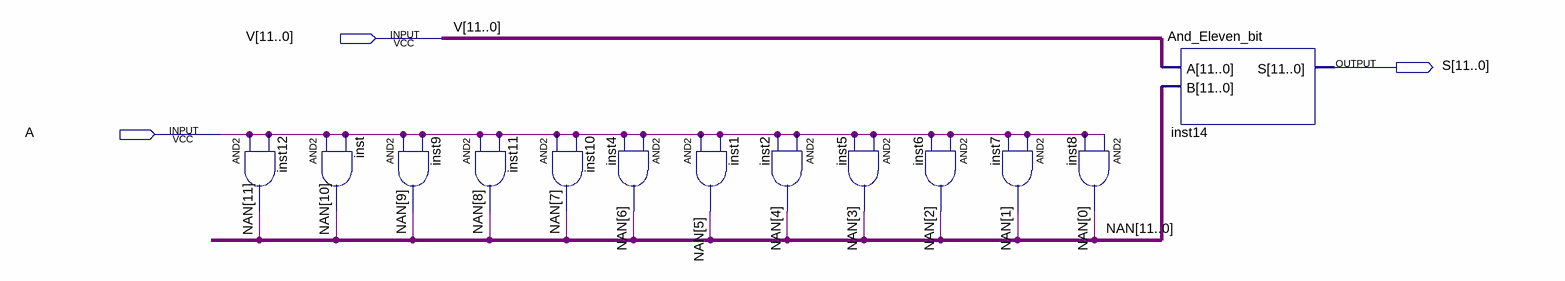
[diagram p0: schematic sheet]
// Quartus schematic And_Mux_BCD.bdf as structural Verilog: 13 symbols, 3 pins
module And_Mux_BCD (
  input  [11:0] V,
  input  A,
  output [11:0] S
);

  wire [11:0] NAN;

  and inst12 (NAN[11], A, A);
  and inst (NAN[10], A, A);
  and inst9 (NAN[9], A, A);
  and inst11 (NAN[8], A, A);
  and inst10 (NAN[7], A, A);
  and inst4 (NAN[6], A, A);
  and inst1 (NAN[5], A, A);
  and inst2 (NAN[4], A, A);
  and inst5 (NAN[3], A, A);
  and inst6 (NAN[2], A, A);
  and inst7 (NAN[1], A, A);
  and inst8 (NAN[0], A, A);
  And_Eleven_bit inst14 (.A(V), .B(NAN), .S(S));
endmodule
